# Altium schematic sheet EEG AFE Sheet 4.SchDoc
size A4; SheetNumber: 4; SheetTotal: 4
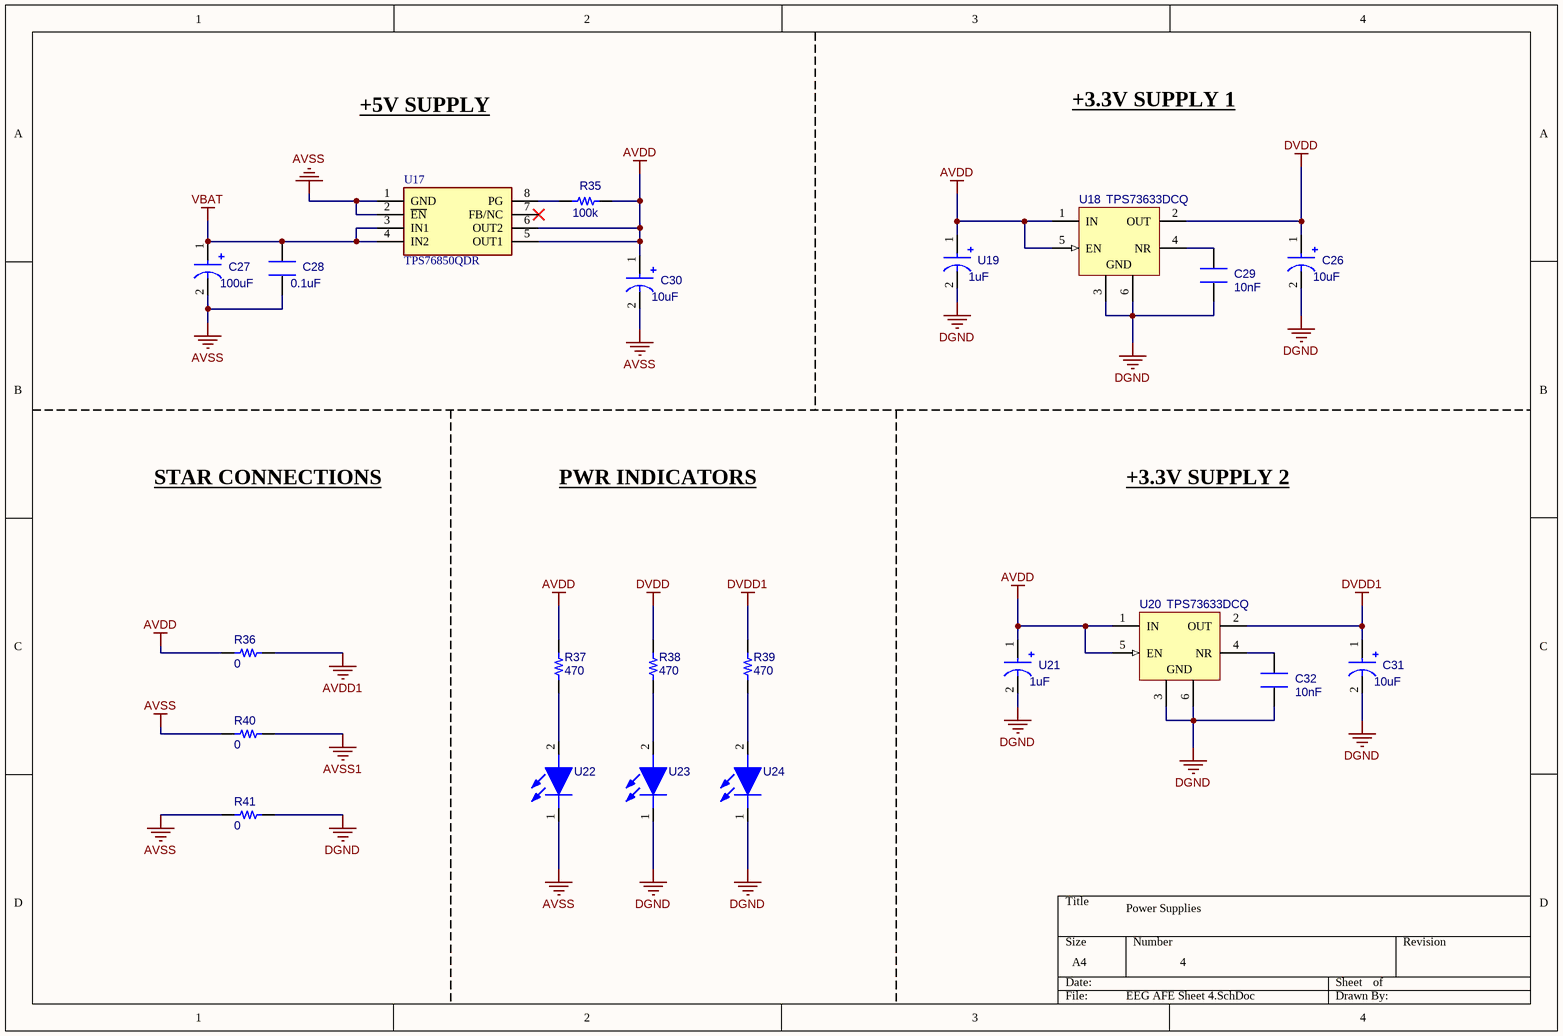
[diagram p0: EEG AFE Sheet 4.SchDoc]

## Parts
C26  10uF  [CAP ALSMD ELEC 4.3MM H5.4MM]
C27  100uF  [CAP ALSMD ELEC 6.6MM H7.7MM]
C28  0.1uF  [CAP 0603_1608]
C29  10nF  [CAP 0603_1608]
C30  10uF  [CAP ALSMD ELEC 4.3MM H5.4MM]
C31  10uF  [CAP ALSMD ELEC 4.3MM H5.4MM]
C32  10nF  [CAP 0603_1608]
R35  100k  [RES 0603_1608]
R36  0  [RES 0603_1608]
R37  470  [RES 0603_1608]
R38  470  [RES 0603_1608]
R39  470  [RES 0603_1608]
R40  0  [RES 0603_1608]
R41  0  [RES 0603_1608]
U17  TPS76850QDR  [SOIC127P600X175-8N]
U18  TPS73633DCQ  [SOT127P706X180-6N]
U19  1uF  [CAPC0805_TANT]
U20  TPS73633DCQ  [SOT127P706X180-6N]
U21  1uF  [CAPC0805_TANT]
U22  *  [LEDC2012X80N]  (value not drawn)
U23  *  [LEDC2012X80N]  (value not drawn)
U24  *  [LEDC2012X80N]  (value not drawn)

## Nets
AVDD: C30.1(C) R35.1 R36.2 R37.2 U17.5(OUT1) U17.6(OUT2) U18.1(IN) U18.5(EN) U19.1(C) U20.1(IN) U20.5(EN) U21.1(C)
AVDD1: R36.1
AVSS: C27.2(A) C28.1 C30.2(A) R40.2 R41.2 U17.1(GND) U17.2(~{EN}) U22.1(K)
AVSS1: R40.1
DGND: C26.2(A) C29.1 C31.2(A) C32.1 R41.1 U18.3(GND) U18.6(GND) U19.2(A) U20.3(GND) U20.6(GND) U21.2(A) U23.1(K) U24.1(K)
DVDD: C26.1(C) R38.2 U18.2(OUT)
DVDD1: C31.1(C) R39.2 U20.2(OUT)
VBAT: C27.1(C) C28.2 U17.3(IN1) U17.4(IN2)
NetC29_2: C29.2 U18.4(NR)
NetC32_2: C32.2 U20.4(NR)
NetR35_2: R35.2 U17.8(PG)
NetR37_1: R37.1 U22.2(A)
NetR38_1: R38.1 U23.2(A)
NetR39_1: R39.1 U24.2(A)

Not connected (* = marked no-connect by the designer): U17 7(FB/NC)*

## Notes on the sheet
- +5V SUPPLY
- +3.3V SUPPLY 1
- STAR CONNECTIONS
- PWR INDICATORS
- +3.3V SUPPLY 2
- Power Supplies
- 4

## Library data of the parts
C26 C30 C31 = EEE-FK1E100R: Aluminum Electrolytic Capacitor, Polarized, Aluminum (wet), 25V, 20% +Tol, 20% -Tol, 10uF, Surface Mount, 1717; Manufacturer: ???; Dielectric Material: Aluminium; Leakage Current: 2.5uA; Ripple Current: 67.5mA; Tan Delta: 0.14; Reference Standard: AEC-Q200; Package: CAP ALSMD ELEC 4.3MM H5.4MM; Part Number: *; Value: *; Voltage: *; Tolerance: *; ComponentLink1Description: Datasheet; Current Rating: *; Supplier 1: Mouser; Manufacturer Part Number: EEE-FK1E100R; RoHS: Yes; Category: Aluminum Electrolytic Capacitors; Stock 1: 28194; Pricing 1: 1=0.5, 10=0.342, 50=0.239, 100=0.205, 1000=0.145, 10000=0.136 (USD); Mount: Surface Mount; Number of Pins: 2; Size Code: 1717; Min Operating Temperature: -55°C; Max Operating Temperature: 105°C; Polarity: Polarized; Capacitance: 10uF; Capacitor Type: Aluminium; Negative Tolerance: 20%; Package Style: SMTMeter; Packaging: Tape and Reel; Positive Tolerance: 20%; Rated DC Voltage (URdc): 25V; Termination: Flat; Length: 5.5mm; Width: 4.3mm; Height: 5.8mm; Reach SVHC Compliant: Yes; RoHS Compliant: Yes; ComponentLink2URL: https://datasheet.ciiva.com:443/pdfs/VipMasterIC/IC/PANA/PANA-S-A0009615195/PANA-S-A0009615195-1.pdf?src-supplier=IHS+Markit; ComponentLink2Description: https://datasheet.ciiva.com:443/pdfs/VipMasterIC/IC/PANA/PANA-S-A0009615195/PANA-S-A0009615195-1.pdf?src-supplier=IHS+Markit; ComponentLink3URL: https://datasheet.ciiva.com/27052/1357642-27052071.pdf?src-supplier=Jameco; ComponentLink3Description: https://datasheet.ciiva.com/27052/1357642-27052071.pdf?src-supplier=Jameco; ComponentLink4URL: https://datasheet.ciiva.com/43463/58258-43463510.pdf?src-supplier=Farnell; ComponentLink4Description: https://datasheet.ciiva.com/43463/58258-43463510.pdf?src-supplier=Farnell; ComponentLink5URL: https://datasheet.ciiva.com/46388/58258-46388648.pdf?src-supplier=Element14; ComponentLink5Description: https://datasheet.ciiva.com/46388/58258-46388648.pdf?src-supplier=Element14; ComponentLink6URL: https://datasheet.ciiva.com/24069/aba0000ce120-24069487.pdf?src-supplier=Mouser; ComponentLink6Description: https://datasheet.ciiva.com/24069/aba0000ce120-24069487.pdf?src-supplier=Mouser; ComponentLink7URL: https://datasheet.ciiva.com/43485/1676921-43485493.pdf?src-supplier=Farnell; ComponentLink7Description: https://datasheet.ciiva.com/43485/1676921-43485493.pdf?src-supplier=Farnell; ComponentLink8URL: https://datasheet.ciiva.com/46388/1676921-46388649.pdf?src-supplier=Element14; ComponentLink8Description: https://datasheet.ciiva.com/46388/1676921-46388649.pdf?src-supplier=Element14; ComponentLink9URL: https://datasheet.ciiva.com/6121/1676921-6121167.pdf?src-supplier=Farnell; ComponentLink9Description: https://datasheet.ciiva.com/6121/1676921-6121167.pdf?src-supplier=Farnell; ComponentLink10URL: https://datasheet.ciiva.com/46376/1676921-46376489.pdf?src-supplier=Element14; ComponentLink10Description: https://datasheet.ciiva.com/46376/1676921-46376489.pdf?src-supplier=Element14; ComponentLink11URL: https://datasheet.ciiva.com/2983/aba0000ce120-2983947.pdf?src-supplier=Avnet; ComponentLink11Description: https://datasheet.ciiva.com/2983/aba0000ce120-2983947.pdf?src-supplier=Avnet; ComponentLink12URL: https://datasheet.ciiva.com/16449/aba0000ce120-16449400.pdf?src-supplier=Future+Electronics; ComponentLink12Description: https://datasheet.ciiva.com/16449/aba0000ce120-16449400.pdf?src-supplier=Future+Electronics; ComponentLink13URL: https://datasheet.ciiva.com/30199/aba0000ce120-30199257.pdf?src-supplier=Onlinecomponents.com; ComponentLink13Description: https://datasheet.ciiva.com/30199/aba0000ce120-30199257.pdf?src-supplier=Onlinecomponents.com; ComponentLink14URL: https://datasheet.ciiva.com/15166/getdatasheetpartid-134702-15166021.pdf?src-supplier=Verical; ComponentLink14Description: https://datasheet.ciiva.com/15166/getdatasheetpartid-134702-15166021.pdf?src-supplier=Verical; Supplier Part Number 1: 667-EEE-FK1E100R
C27 = 865230345005: WCAP-AS5H Aluminum Electrolytic Capacitors; Manufacturer: ???; Package: CAP ALSMD ELEC 6.6MM H7.7MM; Publisher: Paraqum Technologies; Part Number: *; Value: *; Voltage: *; Tolerance: *; ComponentLink1Description: Datasheet; Current Rating: *; Supplier 1: Mouser; Manufacturer Part Number: 865230345005; RoHS: Yes; Category: Aluminum Electrolytic Capacitors; Stock 1: 13677; Pricing 1: 1=0.33, 10=0.33, 50=0.281, 100=0.245, 1000=0.185, 10000=0.185 (USD); ComponentLink2URL: http://www.farnell.com/datasheets/1880265.pdf?src-supplier=Farnell; ComponentLink2Description: http://www.farnell.com/datasheets/1880265.pdf?src-supplier=Farnell; ComponentLink3URL: http://www.farnell.com/datasheets/1880265.pdf?src-supplier=Element14; ComponentLink3Description: http://www.farnell.com/datasheets/1880265.pdf?src-supplier=Element14; ComponentLink4URL: http://www.farnell.com/datasheets/1880265.pdf?src-supplier=Newark; ComponentLink4Description: http://www.farnell.com/datasheets/1880265.pdf?src-supplier=Newark; ComponentLink5URL: http://katalog.we-online.de/pbs/datasheet/865230345005.pdf?src-supplier=Digi-Key; ComponentLink5Description: http://katalog.we-online.de/pbs/datasheet/865230345005.pdf?src-supplier=Digi-Key; ComponentLink6URL: https://katalog.we-online.de/pbs/datasheet/865230345005.pdf?src-supplier=Digi-Key; ComponentLink6Description: https://katalog.we-online.de/pbs/datasheet/865230345005.pdf?src-supplier=Digi-Key; Supplier Part Number 1: 710-865230345005
C28 C29 C32 = 08055C104KAT2A: Ceramic Capacitor, Multilayer, Ceramic, 50V, 10% +Tol, 10% -Tol, X7R, 15% TC, 0.1uF, Surface Mount, 0805; Manufacturer: ???; Capacitance: 100nF; Multilayer: Yes; Package: CAP 0603_1608; Part Number: *; Value: *; Voltage: *; Tolerance: *; ComponentLink1Description: Datasheet; Current Rating: *; Supplier 1: Mouser; Manufacturer Part Number: 08055C104KAT2A; RoHS: Yes; Category: Ceramic Capacitors; Stock 1: 1865681; Pricing 1: 1=0.1, 10=0.037, 50=0.037, 100=0.022, 1000=0.017, 10000=0.013 (USD); Mount: Surface Mount; Number of Pins: 2; Dielectric Material: Ceramic; Package Shape: Rectangular; Size Code: 0805; Terminal Finish: Nickel; Min Operating Temperature: -55°C; Max Operating Temperature: 125°C; JESD-609 Code: e3; Capacitor Type: Ceramic; Negative Tolerance: 10%; Package Style: SMTMeter; Packaging: Tape and Reel; Positive Tolerance: 10%; Rated DC Voltage (URdc): 50V; Temperature Characteristics Code: X7R; Termination: Wraparound; Length: 2.01mm; Width: 1.25mm; Height: 0.94mm; Reach SVHC Compliant: Yes; RoHS Compliant: Yes; ComponentLink2URL: https://datasheet.ciiva.com:443/pdfs/VipMasterIC/IC/AVXC/AVXC-S-A0009640452/AVXC-S-A0009640452-1.pdf?src-supplier=IHS+Markit; ComponentLink2Description: https://datasheet.ciiva.com:443/pdfs/VipMasterIC/IC/AVXC/AVXC-S-A0009640452/AVXC-S-A0009640452-1.pdf?src-supplier=IHS+Markit; ComponentLink3URL: https://datasheet.ciiva.com/19475/2009691-19475858.pdf?src-supplier=Jameco; ComponentLink3Description: https://datasheet.ciiva.com/19475/2009691-19475858.pdf?src-supplier=Jameco; ComponentLink4URL: https://datasheet.ciiva.com/11786/0900766b802d4698-11786116.pdf?src-supplier=Rs; ComponentLink4Description: https://datasheet.ciiva.com/11786/0900766b802d4698-11786116.pdf?src-supplier=Rs; ComponentLink5URL: https://datasheet.ciiva.com/2988/cx7r-2988014.pdf?src-supplier=Avnet; ComponentLink5Description: https://datasheet.ciiva.com/2988/cx7r-2988014.pdf?src-supplier=Avnet; ComponentLink6URL: https://datasheet.ciiva.com/16199/cx7r-16199014.pdf?src-supplier=Future+Electronics; ComponentLink6Description: https://datasheet.ciiva.com/16199/cx7r-16199014.pdf?src-supplier=Future+Electronics; ComponentLink7URL: https://datasheet.ciiva.com/11504/cx7r-11504044.pdf?src-supplier=Avnet; ComponentLink7Description: https://datasheet.ciiva.com/11504/cx7r-11504044.pdf?src-supplier=Avnet; ComponentLink8URL: https://datasheet.ciiva.com/150/cx7r-150258.pdf?src-supplier=Digi-Key; ComponentLink8Description: https://datasheet.ciiva.com/150/cx7r-150258.pdf?src-supplier=Digi-Key; ComponentLink9URL: https://datasheet.ciiva.com/150/cx7r-150257.pdf?src-supplier=Digi-Key; ComponentLink9Description: https://datasheet.ciiva.com/150/cx7r-150257.pdf?src-supplier=Digi-Key; ComponentLink10URL: https://datasheet.ciiva.com/150/cx7r-150259.pdf?src-supplier=Digi-Key; ComponentLink10Description: https://datasheet.ciiva.com/150/cx7r-150259.pdf?src-supplier=Digi-Key; ComponentLink11URL: https://datasheet.ciiva.com/7812/cx7r-7812079.pdf?src-supplier=Element14; ComponentLink11Description: https://datasheet.ciiva.com/7812/cx7r-7812079.pdf?src-supplier=Element14; ComponentLink12URL: https://datasheet.ciiva.com/5416/cx7r-5416959.pdf?src-supplier=Mouser; ComponentLink12Description: https://datasheet.ciiva.com/5416/cx7r-5416959.pdf?src-supplier=Mouser; Supplier Part Number 1: 581-08055C104K
R35-R41 = RC0805FR-0710KL: Fixed Resistor, Metal Glaze/thick Film, 0.125W, 10000ohm, 150V, 1% +/-Tol, 100ppm/Cel, Surface Mount, 0805; Manufacturer: ???; Additional Feature: LASER TRIMMABLE; Rated Power Dissipation (P): 125mW; Rated Temperature: 70°C; Resistance: 10kR; Temperature Coefficient: 100ppm/°C; Package Height: 0.5mm; Package Length: 2mm; Package Width: 1.25mm; Package: RES 0603_1608; Publisher: Paraqum Technologies; Part Number: *; Value: *; Voltage: *; Tolerance: *; ComponentLink1Description: Datasheet; Current Rating: *; Supplier 1: Mouser; Manufacturer Part Number: RC0805FR-0710KL; RoHS: Yes; Category: Chip SMD Resistors; Stock 1: 8413916; Pricing 1: 1=0.1, 10=0.034, 50=0.034, 100=0.014, 1000=0.007, 10000=0.004 (USD); Mount: Surface Mount; Number of Pins: 2; Package Shape: Rectangular; Size Code: 0805; Terminal Finish: Nickel; Min Operating Temperature: -55°C; Max Operating Temperature: 155°C; JESD-609 Code: e3; Termination: Wraparound; Resistor Type: FIXED RESISTOR; Construction: Chip; Package Style: SMTMeter; Packaging: Tape and Reel; Technology: METAL GLAZE/THICK FILM; Working Voltage: 150V; Reach SVHC Compliant: Yes; RoHS Compliant: Yes; ComponentLink2URL: https://datasheet.ciiva.com:443/pdfs/VipMasterIC/IC/YAGO/YAGO-S-A0008145938/YAGO-S-A0008145938-1.pdf?src-supplier=IHS+Markit; ComponentLink2Description: https://datasheet.ciiva.com:443/pdfs/VipMasterIC/IC/YAGO/YAGO-S-A0008145938/YAGO-S-A0008145938-1.pdf?src-supplier=IHS+Markit; ComponentLink3URL: https://datasheet.ciiva.com/46447/444164-46447563.pdf?src-supplier=Element14; ComponentLink3Description: https://datasheet.ciiva.com/46447/444164-46447563.pdf?src-supplier=Element14; ComponentLink4URL: https://datasheet.ciiva.com/2456/pyu-r-int-thick-7-2456973.pdf?src-supplier=Digi-Key; ComponentLink4Description: https://datasheet.ciiva.com/2456/pyu-r-int-thick-7-2456973.pdf?src-supplier=Digi-Key; ComponentLink5URL: https://datasheet.ciiva.com/2456/pyu-r-int-thick-7-2456974.pdf?src-supplier=Digi-Key; ComponentLink5Description: https://datasheet.ciiva.com/2456/pyu-r-int-thick-7-2456974.pdf?src-supplier=Digi-Key; ComponentLink6URL: https://datasheet.ciiva.com/2456/pyu-r-int-thick-7-2456972.pdf?src-supplier=Digi-Key; ComponentLink6Description: https://datasheet.ciiva.com/2456/pyu-r-int-thick-7-2456972.pdf?src-supplier=Digi-Key; ComponentLink7URL: https://datasheet.ciiva.com/12669/rc0805-12669688.pdf?src-supplier=Mouser; ComponentLink7Description: https://datasheet.ciiva.com/12669/rc0805-12669688.pdf?src-supplier=Mouser; ComponentLink8URL: https://datasheet.ciiva.com/16747/rc0805-16747087.pdf?src-supplier=Future+Electronics; ComponentLink8Description: https://datasheet.ciiva.com/16747/rc0805-16747087.pdf?src-supplier=Future+Electronics; Supplier Part Number 1: 603-RC0805FR-0710KL
U17 = TPS76850QDR: LDO Voltage Regulators Micropower LDO Reg; Manufacturer_Name: Texas Instruments; Datasheet Link: https://www.ti.com/lit/ds/slvs211l/slvs211l.pdf; Height: 1.75mm; Manufacturer_Part_Number: TPS76850QDR; Mouser Part Number: 595-TPS76850QDR; Mouser Price/Stock: https://www.mouser.com/ProductDetail/Texas-Instruments/TPS76850QDR?qs=6zVL%252ByCp0moMPwCCXDl%252BJA%3D%3D; Arrow Part Number: TPS76850QDR; Arrow Price/Stock: https://www.arrow.com/en/products/tps76850qdr/texas-instruments
U18 U20 = TPS73633DCQ: Fixed Positive LDO Regulator, 3.3V, 0.2V Dropout, BICMOS, PDSO6; Manufacturer: ???; Package Body Material: Plastic; Dropout Voltage1-Max: 200mV; Dropout Voltage1-Nom: 75mV; Input Voltage Absolute-Max: 6V; Max Input Voltage: 5.5V; Min Input Voltage: 3.5V; Number of Functions: 1; Output Current1-Max: 400mA; Output Voltage1-Max: 3.333V; Output Voltage1-Min: 3.267V; Regulator Type: FIXED POSITIVE SINGLE OUTPUT LDO REGULATOR; Voltage Tolerance-Max: 1%; Qualification Status: Not Qualified; Package: SOT127P706X180-6N; Publisher: Paraqum Technologies; Part Number: *; Value: *; Voltage: *; Tolerance: *; ComponentLink1Description: Datasheet; Current Rating: *; Supplier 1: Mouser; Manufacturer Part Number: TPS73633DCQ; RoHS: Yes; Category: Voltage Regulators - Linear; Stock 1: 5912; Pricing 1: 1=2.95, 10=2.8, 50=2.65, 100=2.29, 1000=1.67, 10000=1.44 (USD); Package Code: SOP; Number of Pins: 6; Package Shape: Rectangular; Terminal Finish: Nickel; JESD-609 Code: e4; Adjustability: FIXED; JESD-30 Code: R-PDSO-G6; Moisture Sensitivity Level: 2; Number of Outputs: 1; Operating Temperature, TJ-Max: 125°C; Operating Temperature, TJ-Min: -40°C; Output Voltage1-Nom: 3.3V; Package Style: SMALL OUTLINEMeter; Packaging: Rail/Tube; Peak Reflow Temperature (Cel): 260°C; Surface Mount: Yes; Technology: BICMOS; Terminal Form: Gull Wing; Terminal Position: DUAL; Length: 6.5mm; Width: 3.5mm; Height - Seated (Max): 1.8mm; Terminal Pitch: 1.27mm; Reach SVHC Compliant: Yes; RoHS Compliant: Yes; ComponentLink2URL: https://www.ti.com:443/lit/ds/symlink/tps736.pdf?src-supplier=IHS+Markit; ComponentLink2Description: https://www.ti.com:443/lit/ds/symlink/tps736.pdf?src-supplier=IHS+Markit; ComponentLink3URL: https://datasheet.ciiva.com/2052/tps736-2052920.pdf?src-supplier=Digi-Key; ComponentLink3Description: https://datasheet.ciiva.com/2052/tps736-2052920.pdf?src-supplier=Digi-Key; Supplier Part Number 1: 595-TPS73633DCQ
U19 U21 = TPSR105K025R4000: Tantalum Capacitor, Polarized, Tantalum (dry/solid), 25V, 10% +Tol, 10% -Tol, 1uF, Surface Mount, 0805; Manufacturer: ???; ESR (Equivalent Series Resistance): 4R; Leakage Current: 500nA; Tan Delta: 0.04; Package: CAPC0805_TANT; Publisher: Paraqum Technologies; Part Number: *; Value: *; Voltage: *; Tolerance: *; ComponentLink1Description: Datasheet; Current Rating: *; Supplier 1: Mouser; Manufacturer Part Number: TPSR105K025R4000; RoHS: Yes; Category: Tantalum Capacitors; Stock 1: 11306; Pricing 1: 1=0.93, 10=0.656, 50=0.656, 100=0.431, 1000=0.272, 10000=0.205 (USD); Mount: Surface Mount; Number of Pins: 2; Dielectric Material: Tantalum; Package Shape: Rectangular; Size Code: 0805; Terminal Finish: Nickel; Min Operating Temperature: -55°C; Max Operating Temperature: 125°C; JESD-609 Code: e3; Polarity: Polarized; Capacitance: 1uF; Capacitor Type: Tantalum; Negative Tolerance: 10%; Package Style: SMTMeter; Packaging: Tape and Reel; Positive Tolerance: 10%; Rated DC Voltage (URdc): 25V; Termination: J BEND; Length: 2.05mm; Width: 1.3mm; Height: 1.2mm; Reach SVHC Compliant: Yes; RoHS Compliant: Yes; ComponentLink2URL: https://datasheet.ciiva.com:443/pdfs/VipMasterIC/IC/AVXC/AVXC-S-A0008980848/AVXC-S-A0008980848-1.pdf?src-supplier=IHS+Markit; ComponentLink2Description: https://datasheet.ciiva.com:443/pdfs/VipMasterIC/IC/AVXC/AVXC-S-A0008980848/AVXC-S-A0008980848-1.pdf?src-supplier=IHS+Markit; ComponentLink3URL: http://www.mouser.com/ds/2/40/tps-776850.pdf?src-supplier=Mouser; ComponentLink3Description: http://www.mouser.com/ds/2/40/tps-776850.pdf?src-supplier=Mouser; ComponentLink4URL: http://global.kyocera.com/prdct/electro/pdf/capacitors/taj-ce.pdf?src-supplier=Avnet; ComponentLink4Description: http://global.kyocera.com/prdct/electro/pdf/capacitors/taj-ce.pdf?src-supplier=Avnet; ComponentLink5URL: http://datasheets.avx.com/TPS.pdf?src-supplier=Digi-Key; ComponentLink5Description: http://datasheets.avx.com/TPS.pdf?src-supplier=Digi-Key; Supplier Part Number 1: 581-TPSR105K025R4000
U22-U24 = 150080BS75000: Single Color LED, Blue, Water Clear, 1.4mm; Manufacturer: ???; Shape: Rectangular; Forward Current-Max: 30mA; Luminous Intensity-Nom: 145mcd; Number of Functions: 1; Viewing Angle: 140°; Overall Height: 0.7mm; Package: LEDC2012X80N; Publisher: Paraqum Technologies; Part Number: *; Value: *; Voltage: *; Tolerance: *; ComponentLink1Description: Datasheet; Current Rating: *; Supplier 1: Mouser; Manufacturer Part Number: 150080BS75000; RoHS: Yes; Category: LEDs; Stock 1: 191914; Pricing 1: 1=0.19, 10=0.187, 50=0.176, 100=0.151, 1000=0.131, 10000=0.131 (USD); Mount: Surface Mount; Number of Pins: 2; Color: Blue; Min Operating Temperature: -40°C; Max Operating Temperature: 85°C; Lens Style: WATER CLEAR; Optoelectronic Device Type: SINGLE COLOR LED; Packaging: Tape and Reel; Size: 1.4mm; Terminal Pitch: 2.1mm; RoHS Compliant: Yes; Reach SVHC Compliant: Yes; ComponentLink2URL: https://datasheet.ciiva.com:443/pdfs/VipMasterIC/IC/MIDC/MIDC-S-A0007455543/MIDC-S-A0007455543-1.pdf?src-supplier=IHS+Markit; ComponentLink2Description: https://datasheet.ciiva.com:443/pdfs/VipMasterIC/IC/MIDC/MIDC-S-A0007455543/MIDC-S-A0007455543-1.pdf?src-supplier=IHS+Markit; ComponentLink3URL: https://datasheet.ciiva.com/22656/1740214-22656954.pdf?src-supplier=Element14; ComponentLink3Description: https://datasheet.ciiva.com/22656/1740214-22656954.pdf?src-supplier=Element14; ComponentLink4URL: https://datasheet.ciiva.com/23843/150080bs75000-23843251.pdf?src-supplier=Newark; ComponentLink4Description: https://datasheet.ciiva.com/23843/150080bs75000-23843251.pdf?src-supplier=Newark; ComponentLink5URL: https://datasheet.ciiva.com/29279/759433-da-01-en-chipled-0805-w-kl-blau-150080bs75000-29279203.pdf?src-supplier=Conrad; ComponentLink5Description: https://datasheet.ciiva.com/29279/759433-da-01-en-chipled-0805-w-kl-blau-150080bs75000-29279203.pdf?src-supplier=Conrad; ComponentLink6URL: https://datasheet.ciiva.com/29562/150080bs75000-29562923.pdf?src-supplier=Digi-Key; ComponentLink6Description: https://datasheet.ciiva.com/29562/150080bs75000-29562923.pdf?src-supplier=Digi-Key; ComponentLink7URL: https://datasheet.ciiva.com/29562/150080bs75000-29562922.pdf?src-supplier=Digi-Key; ComponentLink7Description: https://datasheet.ciiva.com/29562/150080bs75000-29562922.pdf?src-supplier=Digi-Key; Supplier Part Number 1: 710-150080BS75000